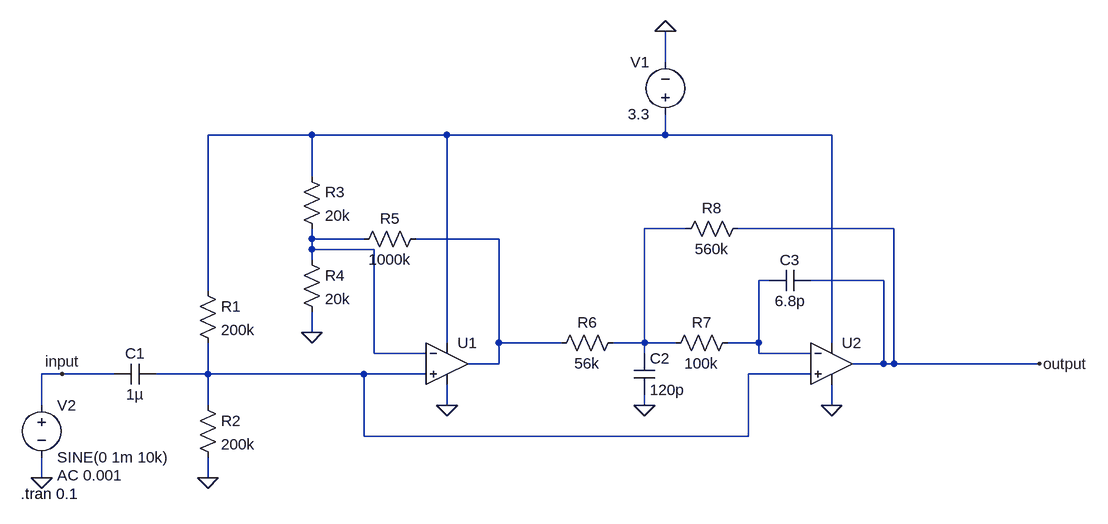
[diagram p0: schematic mikrofon amp.asc]
mikrofon amp.asc, the LTspice schematic file:
Version 4
SHEET 1 1228 680
WIRE 448 -320 448 -368
WIRE -96 -208 -256 -208
WIRE 112 -208 -96 -208
WIRE 448 -208 448 -240
WIRE 448 -208 112 -208
WIRE 704 -208 448 -208
WIRE -96 -144 -96 -208
WIRE 480 -64 416 -64
WIRE 800 -64 560 -64
WIRE -96 -48 -96 -64
WIRE -16 -48 -96 -48
WIRE 192 -48 64 -48
WIRE -96 -32 -96 -48
WIRE 0 -32 -96 -32
WIRE -96 -16 -96 -32
WIRE 608 16 592 16
WIRE 784 16 672 16
WIRE -256 32 -256 -208
WIRE -96 96 -96 64
WIRE 112 112 112 -208
WIRE 192 112 192 -48
WIRE 288 112 192 112
WIRE 416 112 416 -64
WIRE 416 112 368 112
WIRE 464 112 416 112
WIRE 592 112 592 16
WIRE 592 112 544 112
WIRE 704 112 704 -208
WIRE 0 128 0 -32
WIRE 80 128 0 128
WIRE 416 128 416 112
WIRE 592 128 592 112
WIRE 672 128 592 128
WIRE 192 144 192 112
WIRE 192 144 144 144
WIRE 784 144 784 16
WIRE 784 144 736 144
WIRE 800 144 800 -64
WIRE 800 144 784 144
WIRE 1024 144 800 144
WIRE -480 160 -512 160
WIRE -400 160 -480 160
WIRE -256 160 -256 112
WIRE -256 160 -336 160
WIRE -16 160 -256 160
WIRE 80 160 -16 160
WIRE 672 160 576 160
WIRE -512 208 -512 160
WIRE -256 208 -256 160
WIRE 112 208 112 176
WIRE 416 208 416 192
WIRE 704 208 704 176
WIRE -16 256 -16 160
WIRE 576 256 576 160
WIRE 576 256 -16 256
WIRE -512 320 -512 288
WIRE -256 320 -256 288
FLAG 448 -368 0
FLAG 112 208 0
FLAG 704 208 0
FLAG -256 320 0
FLAG -96 96 0
FLAG -512 320 0
FLAG -480 160 input
FLAG 416 208 0
FLAG 1024 144 output
SYMBOL voltage 448 -224 R180
WINDOW 0 24 96 Left 2
WINDOW 3 24 16 Left 2
WINDOW 123 0 0 Left 2
WINDOW 39 0 0 Left 2
SYMATTR InstName V1
SYMATTR Value 3.3
SYMBOL cap -336 144 R90
WINDOW 0 0 32 VBottom 2
WINDOW 3 32 32 VTop 2
SYMATTR InstName C1
SYMATTR Value 1µ
SYMBOL res -272 16 R0
SYMATTR InstName R1
SYMATTR Value 200k
SYMBOL res -272 192 R0
SYMATTR InstName R2
SYMATTR Value 200k
SYMBOL res -112 -160 R0
SYMATTR InstName R3
SYMATTR Value 20k
SYMBOL res -112 -32 R0
SYMATTR InstName R4
SYMATTR Value 20k
SYMBOL res 80 -64 R90
WINDOW 0 0 56 VBottom 2
WINDOW 3 32 56 VTop 2
SYMATTR InstName R5
SYMATTR Value 1000k
SYMBOL voltage -512 192 R0
WINDOW 123 24 124 Left 2
WINDOW 39 24 124 Left 2
SYMATTR Value2 AC 0.001
SYMATTR InstName V2
SYMATTR Value SINE(0 1m 10k)
SYMBOL Opamps\\UniversalOpamp2 112 144 R0
SYMATTR InstName U1
SYMBOL Opamps\\UniversalOpamp2 704 144 R0
SYMATTR InstName U2
SYMBOL res 384 96 R90
WINDOW 0 0 56 VBottom 2
WINDOW 3 32 56 VTop 2
SYMATTR InstName R6
SYMATTR Value 56k
SYMBOL res 560 96 R90
WINDOW 0 0 56 VBottom 2
WINDOW 3 32 56 VTop 2
SYMATTR InstName R7
SYMATTR Value 100k
SYMBOL cap 400 128 R0
SYMATTR InstName C2
SYMATTR Value 120p
SYMBOL res 576 -80 R90
WINDOW 0 0 56 VBottom 2
WINDOW 3 32 56 VTop 2
SYMATTR InstName R8
SYMATTR Value 560k
SYMBOL cap 672 0 R90
WINDOW 0 0 32 VBottom 2
WINDOW 3 32 32 VTop 2
SYMATTR InstName C3
SYMATTR Value 6.8p
TEXT -544 344 Left 2 !.tran 0.1

The netlist it stands for:
* mikrofon amp.asc
V1 N001 0 3.3
C1 N006 input 1µ
R1 N001 N006 200k
R2 N006 0 200k
R3 N001 N003 20k
R4 N003 0 20k
R5 N004 N003 1000k
V2 input 0 SINE(0 1m 10k) AC 0.001
XU1 N006 N003 N001 0 N004 level.2 Avol=1Meg GBW=10Meg Slew=10Meg ilimit=25m rail=0 Vos=0 phimargin=45 en=0 enk=0 in=0 ink=0 Rin=500Meg  ; pins IN+ IN- V+ V- OUT
XU2 N006 N005 N001 0 output level.2 Avol=1Meg GBW=10Meg Slew=10Meg ilimit=25m rail=0 Vos=0 phimargin=45 en=0 enk=0 in=0 ink=0 Rin=500Meg  ; pins IN+ IN- V+ V- OUT
R6 N002 N004 56k
R7 N005 N002 100k
C2 N002 0 120p
R8 output N002 560k
C3 output N005 6.8p
.tran 0.1
.lib UniversalOpamps2.sub
.backanno
.end